# EAGLE schematic projector-cooling (EAGLE 8.1.0)
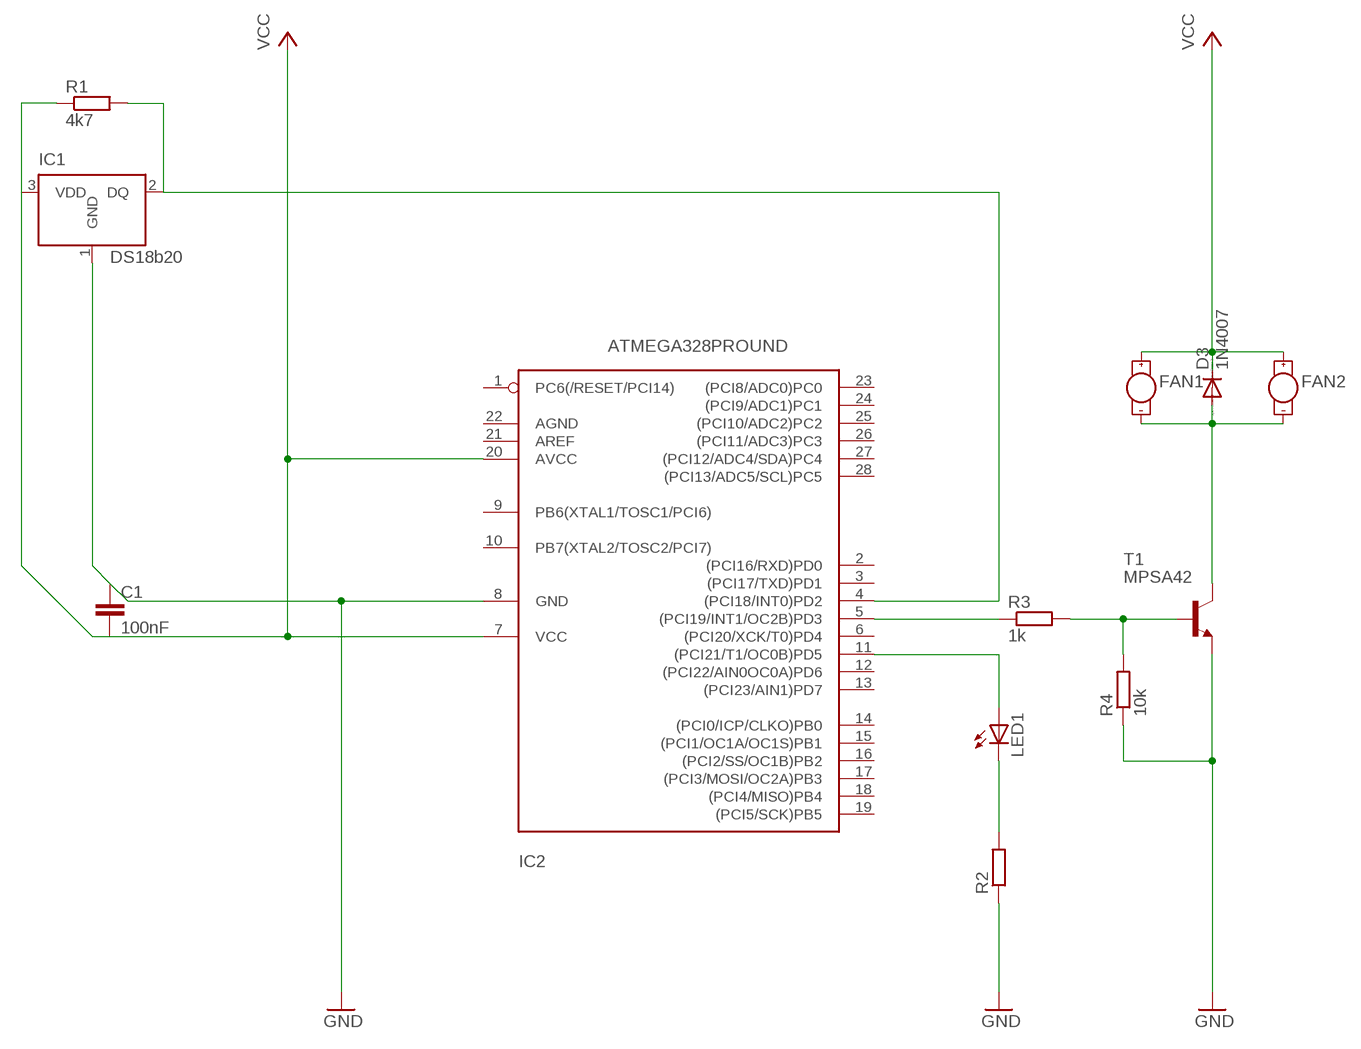
[diagram p0: schematic, sheet 1]

## Parts
C1  100nF  C5/2.5  [C5B2.5]
D3  1N4007  1N4004  [DO41-10]
FAN1  MOTOR10MM  [VIBE-MOTOR-10MM]
FAN2  MOTOR10MM  [VIBE-MOTOR-10MM]
IC1  DS18b20  DS1820  [TO-92]
IC2  ATMEGA328PROUND  [DIL28-3-ROUND]
LED1  LED3MM  [LED3MM]
R1  4k7  R-EU_0204/7  [0204/7]
R2  R-EU_0204/5  [0204/5]
R3  1k  R-EU_0204/5  [0204/5]
R4  10k  R-EU_0204/5  [0204/5]
T1  MPSA42  2N3704  [TO92]

## Nets
GND: C1.1 IC1.1(GND) IC2.8(GND) R2.1 R4.1 T1.3(E)
N$1: IC1.2(DQ) IC2.4((PCI18/INT0)PD2) R1.2
N$2: LED1.K(C) R2.2
N$3: IC2.11((PCI21/T1/OC0B)PD5) LED1.A
N$4: IC2.5((PCI19/INT1/OC2B)PD3) R3.1
N$5: R3.2 R4.2 T1.1(B)
N$7: D3.A FAN1.- FAN2.- T1.2(C)
VCC: C1.2 D3.C FAN1.+ FAN2.+ IC1.3(VDD) IC2.7(VCC) IC2.20(AVCC) R1.1
Unconnected: IC2.1(PC6(/RESET/PCI14)) IC2.2((PCI16/RXD)PD0) IC2.3((PCI17/TXD)PD1) IC2.6((PCI20/XCK/T0)PD4) IC2.9(PB6(XTAL1/TOSC1/PCI6)) IC2.10(PB7(XTAL2/TOSC2/PCI7)) IC2.12((PCI22/AIN0OC0A)PD6) IC2.13((PCI23/AIN1)PD7) IC2.14((PCI0/ICP/CLKO)PB0) IC2.15((PCI1/OC1A/OC1S)PB1) IC2.16((PCI2/SS/OC1B)PB2) IC2.17((PCI3/MOSI/OC2A)PB3) IC2.18((PCI4/MISO)PB4) IC2.19((PCI5/SCK)PB5) IC2.21(AREF) IC2.22(AGND) IC2.23((PCI8/ADC0)PC0) IC2.24((PCI9/ADC1)PC1) IC2.25((PCI10/ADC2)PC2) IC2.26((PCI11/ADC3)PC3) IC2.27((PCI12/ADC4/SDA)PC4) IC2.28((PCI13/ADC5/SCL)PC5)

## Library data of the parts
C1 = capacitor-wima:C: CAPACITOR naming: grid - package width
D3 = diode:1N4004: DIODE general purpose rectifier, 1 A
FAN1 FAN2 = SparkFun-Electromechanical:MOTOR: Motor (Single-Phase) Two-terminal, single-phase motors. SparkFun Products Vibration Motor <https://www.sparkfun.com/products/8449> (ROB-08449) Physical dimension and wire connections for this powerful vibration motor. Motor has a self adhesive backing.; PROD_ID: COMP-08572; SF_SKU: ROB-08449
IC1 = DS1820:DS1820: DS1820 - 1-Wire Digital Thermometer
IC2 = atmega328:ATMEGA328*P: MICROCONTROLLER 32 kBytes FLASH 2 kBytes SRAM 1 kBytes EEPROM USART 8-channel 10 bit ADC
LED1 = led:LED: LED OSRAM: - CHIPLED LG R971, LG N971, LY N971, LG Q971, LY Q971, LO R971, LY R971 LH N974, LH R974 LS Q976, LO Q976, LY Q976 LO Q996 - Hyper CHIPLED LW Q18S LB Q993, LB Q99A, LB R99A - SideLED LS A670, LO A670, LY A670, LG A670, LP A670 LB A673, LV A673, LT A673, LW A673 LH A674 LY A675 LS A676, LA A676, LO A676, LY A676, LW A676 LS A679, LY A679, LG A679 - Hyper Micro SIDELED® LS Y876, LA Y876, LO Y876, LY Y876 LT Y87S - SmartLED LW L88C, LW L88S LB L89C, LB L89S, LG L890 LS L89K, LO L89K, LY L89K LS L896, LA L896, LO L896, LY L896 - TOPLED LS T670, LO T670, LY T670, LG T670, LP T670 LSG T670, LSP T670, LSY T670, LOP T670, LYG T670 LG T671, LOG T671, LSG T671 LB T673, LV T673, LT T673, LW T673 LH T674 LS T676, LA T676, LO T676, LY T676, LB T676, LH T676, LSB T676, LW T676 LB T67C, LV T67C, LT T67C, LS T67K, LO T67K, LY T67K, LW E67C LS E67B, LA E67B, LO E67B, LY E67B, LB E67C, LV E67C, LT E67C LW T67C LS T679, LY T679, LG T679 LS T770, LO T770, LY T770, LG T770, LP T770 LB T773, LV T773, LT T773, LW T773 LH T774 LS E675, LA E675, LY E675, LS T675 LS T776, LA T776, LO T776, LY T776, LB T776 LHGB T686 LT T68C, LB T68C - Hyper Mini TOPLED® LB M676 - Mini TOPLED Santana® LG M470 LS M47K, LO M47K, LY M47K Source: http://www.osram.convergy.de LUXEON: - LUMILED® LXK2-PW12-R00, LXK2-PW12-S00, LXK2-PW14-U00, LXK2-PW14-V00 LXK2-PM12-R00, LXK2-PM12-S00, LXK2-PM14-U00 LXK2-PE12-Q00, LXK2-PE12-R00, LXK2-PE12-S00, LXK2-PE14-T00, LXK2-PE14-U00 LXK2-PB12-K00, LXK2-PB12-L00, LXK2-PB12-M00, LXK2-PB14-N00, LXK2-PB14-P00, LXK2-PB14-Q00 LXK2-PR12-L00, LXK2-PR12-M00, LXK2-PR14-Q00, LXK2-PR14-R00 LXK2-PD12-Q00, LXK2-PD12-R00, LXK2-PD12-S00 LXK2-PH12-R00, LXK2-PH12-S00 LXK2-PL12-P00, LXK2-PL12-Q00, LXK2-PL12-R00 Source: www.luxeon.com KINGBRIGHT: KA-3528ASYC Source: www.kingbright.com
R1-R4 = resistor:R-EU_: RESISTOR, European symbol
T1 = transistor:2N3704: NPN TRANSISTOR